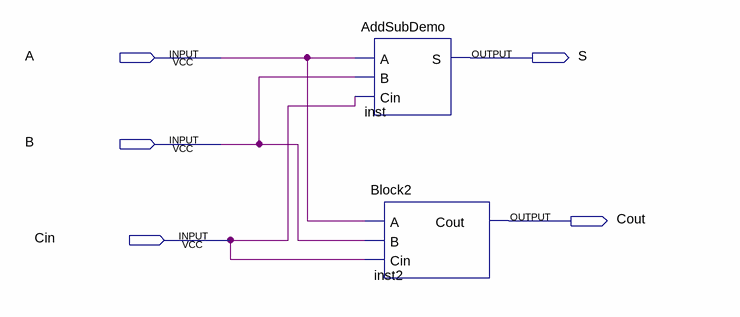
[diagram p0: schematic sheet]
// Quartus schematic AddSubDemo.bdf as structural Verilog: 2 symbols, 5 pins
module AddSubDemo (
  input  A,
  input  B,
  input  Cin,
  output S,
  output Cout
);

  AddSubDemo inst (.A(A), .B(B), .Cin(Cin), .S(S));
  Block2 inst2 (.A(A), .B(B), .Cin(Cin), .Cout(Cout));
endmodule
